# Altium schematic sheet MCU.SchDoc
size 279 x 215 mm; SheetNumber: 3; SheetTotal: 4; SPICEModelCacheLZXJEGGY: <root> / <DocumentId>LZXJEGGY</DocumentId> / <CacheFrame Number="0"> / <Model Name="cap" Kind="MDL"> / <Text>*Default semiconductor capacitor / .MODEL CAP C()</Text> / </Model> / </CacheFrame> / </root>
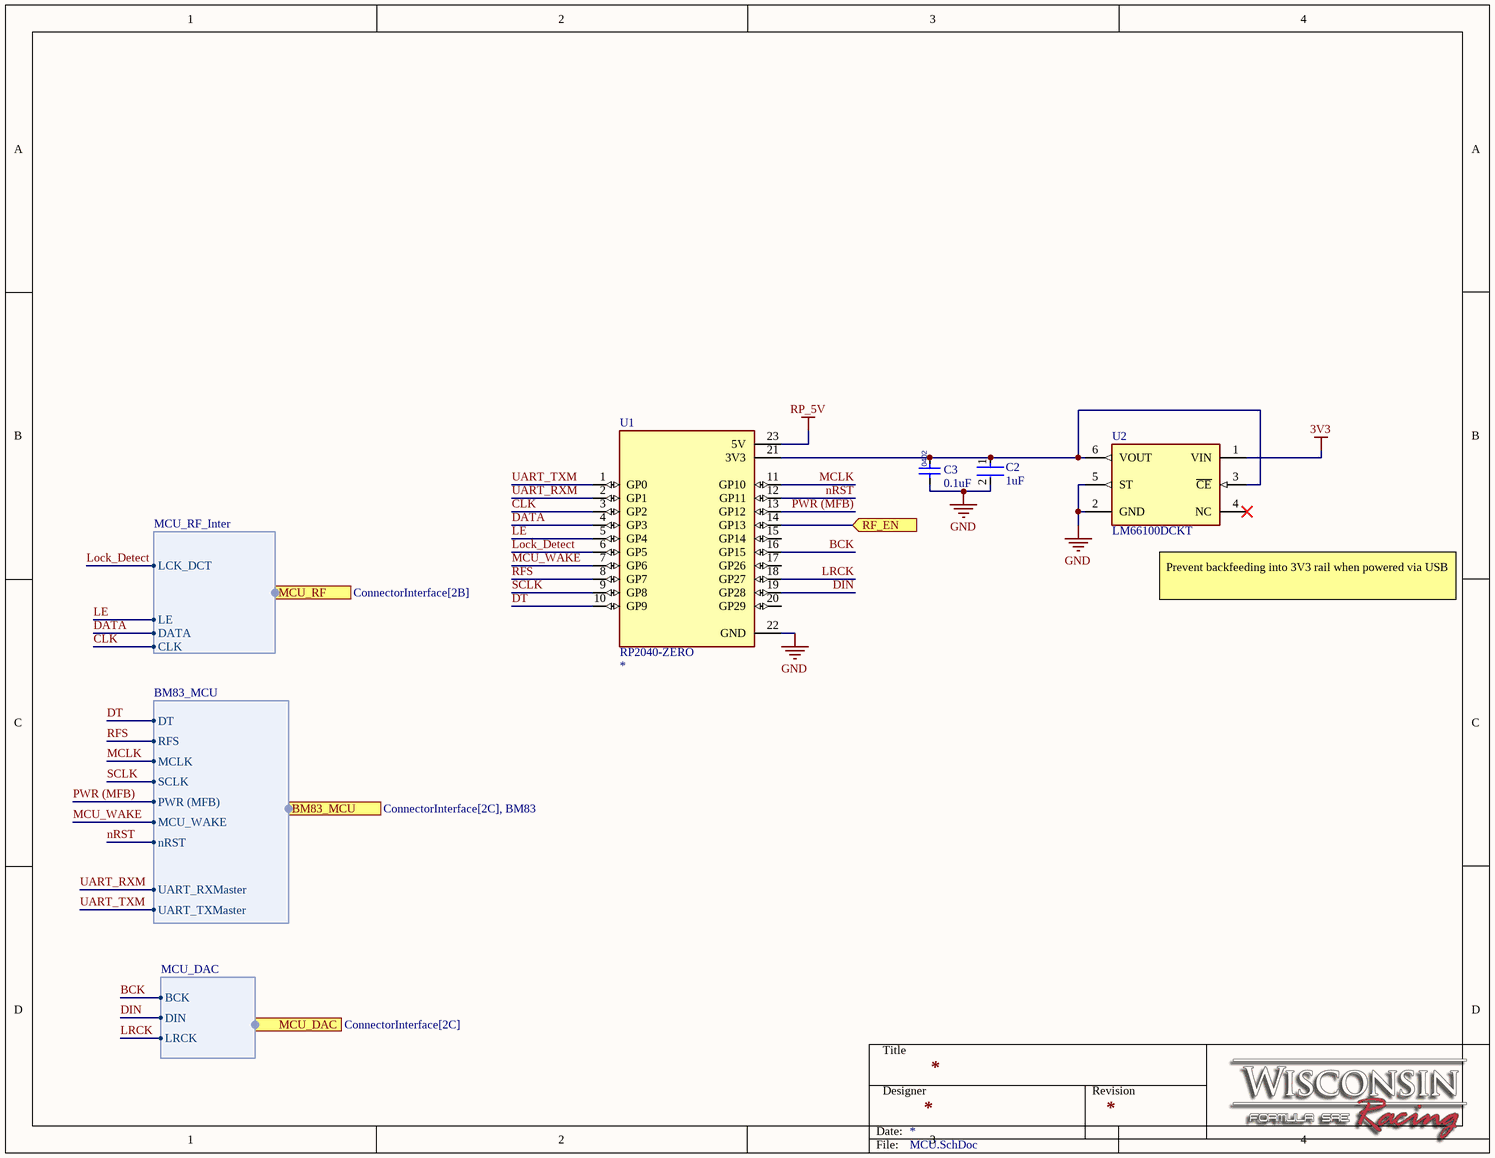
[diagram p0: MCU.SchDoc]

## Parts
C2  1uF  [FP-GRM155-0_1-IPC_C]
C3  0.1uF  [FP-CC0402-IPC_B]
U1  RP2040-ZERO  [MODULE_RP2040-ZERO]
U2  LM66100DCKT  [FP-DCK0006A-IPC_C]

## Ports
BM83_MCU (harness BM83_MCU, see ConnectorInterface[2C], BM83), MCU_DAC (harness MCU_DAC, see ConnectorInterface[2C]), MCU_RF (harness MCU_RF_Inter, see ConnectorInterface[2B]), RF_EN (in, see ConnectorInterface[2C], DIG_PDU)

## Harnesses
BM83_MCU: MCLK, MCU_WAKE, SCLK, PWR (MFB), RFS, DT, nRST, UART_TXMaster, UART_RXMaster
MCU_RF_Inter: LCK_DCT, LE, DATA, CLK
MCU_DAC: BCK, DIN, LRCK

## Nets
3V3: U2.1(VIN)
GND: C2.2 C3.1 U1.22(GND) U2.2(GND) U2.5(ST)
RP_5V: U1.23(5V)
BCK: U1.16(GP15) ; port MCU_DAC.BCK
CLK: U1.3(GP2) ; port MCU_RF.CLK
DATA: U1.4(GP3) ; port MCU_RF.DATA
DIN: U1.19(GP28) ; port MCU_DAC.DIN
DT: U1.10(GP9) ; port BM83_MCU.DT
LE: U1.5(GP4) ; port MCU_RF.LE
Lock_Detect: U1.6(GP5) ; port MCU_RF.LCK_DCT
LRCK: U1.18(GP27) ; port MCU_DAC.LRCK
MCLK: U1.11(GP10) ; port BM83_MCU.MCLK
MCU_WAKE: U1.7(GP6) ; port BM83_MCU.MCU_WAKE
nRST: U1.12(GP11) ; port BM83_MCU.nRST
PWR (MFB): U1.13(GP12) ; port BM83_MCU.PWR (MFB)
RF_EN: U1.14(GP13) ; port RF_EN
RFS: U1.8(GP7) ; port BM83_MCU.RFS
SCLK: U1.9(GP8) ; port BM83_MCU.SCLK
UART_RXM: U1.2(GP1) ; port BM83_MCU.UART_RXMaster
UART_TXM: U1.1(GP0) ; port BM83_MCU.UART_TXMaster
NetC2_1: C2.1 C3.2 U1.21(3V3) U2.3(~{CE}) U2.6(VOUT)

Not connected (* = marked no-connect by the designer): U1 15(GP14) 17(GP26) 20(GP29); U2 4(NC)*

## Notes on the sheet
- (near U2) Prevent backfeeding into 3V3 rail when powered via USB
- Title
- Designer
- Revision
- Date:
- File:
- (in symbol CMP-Cap-00006-1) 0402

## Library data of the parts
C2 = CMP-06035-028020-1: Chip Multilayer Ceramic Capacitors for General Purpose, 0402, 1.0uF, X7R, 15%, 10%, 10V / GRM155Z71A105KE01D
C3 = CMP-Cap-00006-1: Ceramic Capacitor, Multilayer, Ceramic, 16V, 10% +Tol, 10% -Tol, X7R, 15% TC, 0.1uF, Surface Mount, 0402; Dielectric: XR7; Capacitance: 100nF; Tolerance: 10%; Voltage Rating: 16V
U1 = CMP-202-000000-5: Low-Cost, High-Performance Pico-Like MCU Board Based On Raspberry Pi Microcontroller RP2040; MF: Waveshare Electronics; MP: RP2040-ZERO; Component Type: Standard; Value: *; Source: RP2040-ZERO.SchLib; Pin Count: 23; Check_prices: https://www.snapeda.com/parts/RP2040-ZERO/Waveshare+Electronics/view-part/?ref=eda; SnapEDA_Link: https://www.snapeda.com/parts/RP2040-ZERO/Waveshare+Electronics/view-part/?ref=snap; Package: Package; Design Item ID: RP2040-ZERO
U2 = CMP-04910-000059-1: IC OR CTRLR IDEAL DIODE SC70-6